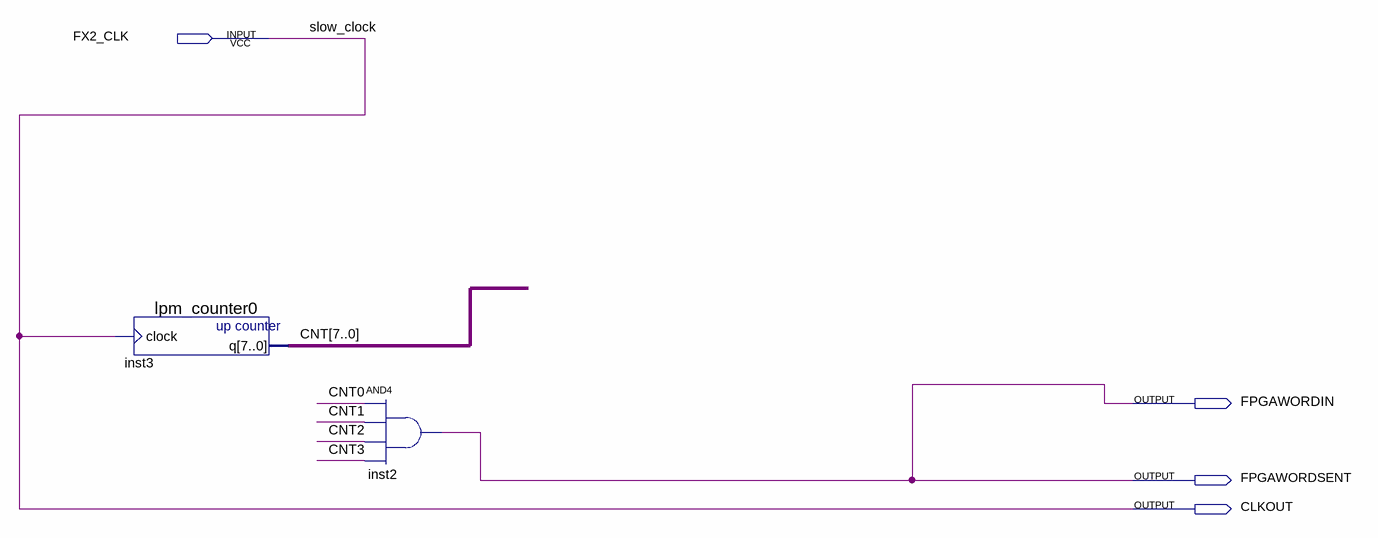
[diagram p0: schematic sheet]
// Quartus schematic testingigo-yyy.bdf as structural Verilog: 2 symbols, 4 pins
module \testingigo-yyy  (
  input  FX2_CLK,
  output FPGAWORDIN,
  output FPGAWORDSENT,
  output CLKOUT
);

  wire [7:0] CNT;

  lpm_counter0 inst3 (.clock(FX2_CLK), .q(CNT));
  and inst2 (FPGAWORDIN, CNT[0], CNT[1], CNT[2], CNT[3]);

  assign CLKOUT = FX2_CLK;
  assign FPGAWORDSENT = FPGAWORDIN;

  // Other names for the same wires on the sheet: slow_clock = FX2_CLK
endmodule
